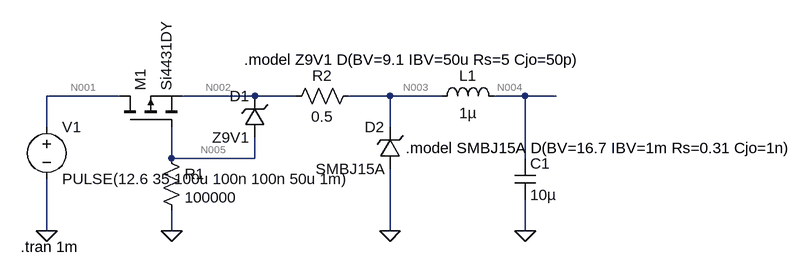
[diagram p0: schematic Power Schematic Verification.asc]
Power Schematic Verification.asc, the LTspice schematic file:
Version 4.1
SHEET 1 1304 680
WIRE 224 96 112 96
WIRE 432 96 320 96
WIRE 496 96 432 96
WIRE 640 96 576 96
WIRE 720 96 640 96
WIRE 848 96 800 96
WIRE 896 96 848 96
WIRE 112 144 112 96
WIRE 640 144 640 96
WIRE 304 192 304 144
WIRE 432 192 432 160
WIRE 432 192 304 192
WIRE 848 192 848 96
WIRE 112 304 112 224
WIRE 304 304 304 272
WIRE 640 304 640 208
WIRE 848 304 848 256
FLAG 112 304 0
FLAG 304 304 0
FLAG 640 304 0
FLAG 848 304 0
SYMBOL voltage 112 128 R0
WINDOW 123 0 0 Left 0
WINDOW 39 0 0 Left 0
SYMATTR InstName V1
SYMATTR Value PULSE(12.6 35 100u 100n 100n 50u 1m)
SYMBOL pmos 224 144 R270
SYMATTR InstName M1
SYMATTR Value Si4431DY
SYMBOL res 288 176 R0
SYMATTR InstName R1
SYMATTR Value 100000
SYMBOL zener 448 160 R180
WINDOW 0 24 64 Left 2
WINDOW 3 24 0 Left 2
SYMATTR InstName D1
SYMATTR Value Z9V1
SYMBOL res 592 80 R90
WINDOW 0 0 56 VBottom 2
WINDOW 3 32 56 VTop 2
SYMATTR InstName R2
SYMATTR Value 0.5
SYMBOL zener 656 208 R180
WINDOW 0 24 64 Left 2
WINDOW 3 24 0 Left 2
SYMATTR InstName D2
SYMATTR Value SMBJ15A
SYMBOL ind 704 112 R270
WINDOW 0 32 56 VTop 2
WINDOW 3 5 56 VBottom 2
SYMATTR InstName L1
SYMATTR Value 1µ
SYMATTR SpiceLine Rser=1m
SYMBOL cap 832 192 R0
SYMATTR InstName C1
SYMATTR Value 10µ
TEXT 664 176 Left 2 !.model SMBJ15A D(BV=16.7 IBV=1m Rs=0.31 Cjo=1n)
TEXT 416 40 Left 2 !.model Z9V1 D(BV=9.1 IBV=50u Rs=5 Cjo=50p)
TEXT 72 328 Left 2 !.tran 1m

The netlist it stands for:
* Power Schematic Verification.asc
V1 N001 0 PULSE(12.6 35 100u 100n 100n 50u 1m)
M1 N001 N005 N002 N002 Si4431DY
R1 N005 0 100000
D1 N005 N002 Z9V1
R2 N003 N002 0.5
D2 0 N003 SMBJ15A
L1 N003 N004 1µ Rser=1m
C1 N004 0 10µ
.model D D
.lib standard.dio
.model NMOS NMOS
.model PMOS PMOS
.lib standard.mos
.model SMBJ15A D(BV=16.7 IBV=1m Rs=0.31 Cjo=1n)
.model Z9V1 D(BV=9.1 IBV=50u Rs=5 Cjo=50p)
.tran 1m
.backanno
.end

* Results of the author's LTspice run, read from the files saved beside the schematic
* Operating Point, zero values left out:
*   V(n001) = 12.6 V
*   V(n002) = 12.6 V
*   V(n003) = 12.6 V
*   V(n004) = 12.6 V
*   V(n005) = 3.509 V
*   I(D1) = -35.09 µA
*   I(D2) = -12.61 pA
*   I(R1) = 35.09 µA
*   I(R2) = -12.61 pA
*   I(V1) = -35.09 µA
*   Id(M1) = 35.09 µA
*   Is(M1) = -35.09 µA
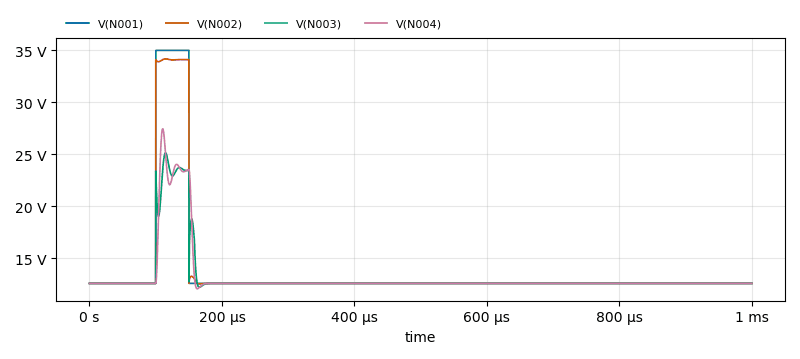
[diagram p1: Transient Analysis of Power Schematic Verification.asc, plotted from the saved traces]
* Transient Analysis, 1 run:
*   V(N001): min 12.6 V, max 35 V, average 13.72 V, rms 14.57 V, last 12.6 V
*   V(N002): min 12.56 V, max 34.18 V, average 13.68 V, rms 14.46 V, last 12.6 V
*   V(N003): min 12.23 V, max 25.16 V, average 13.17 V, rms 13.38 V, last 12.6 V
*   V(N004): min 12.08 V, max 27.46 V, average 13.17 V, rms 13.4 V, last 12.6 V